# EAGLE design RC_Controller_2 (EAGLE 9.6.2)

## Sheet 1 of 3
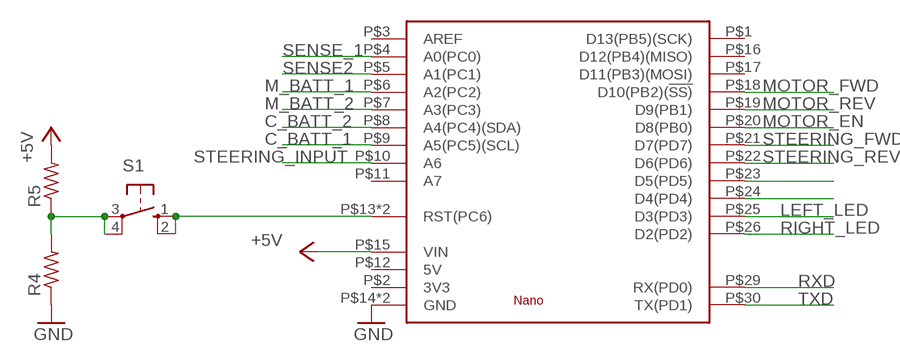
[diagram p0: schematic, sheet 1]

### Parts
R4  R-US_R1206  [R1206]
R5  R-US_R1206  [R1206]
S1  10-XX  [B3F-10XX]
U$1  ARDUINO_NANO  [NANO]

### Nets
+5V: R5.2 U$1.P$15(VIN) ; also sheet 2,3
C_BATT_1: U$1.P$9(A5(PC5)(SCL)) ; also sheet 3
C_BATT_2: U$1.P$8(A4(PC4)(SDA)) ; also sheet 3
GND: R4.1 U$1.P$14(GND) U$1.P$27(GND) ; also sheet 2,3
LEFT_LED: U$1.P$25(D3(PD3)) ; also sheet 3
M_BATT_1: U$1.P$6(A2(PC2)) ; also sheet 3
M_BATT_2: U$1.P$7(A3(PC3)) ; also sheet 3
MOTOR_EN: U$1.P$20(D8(PB0)) ; also sheet 2
MOTOR_FWD: U$1.P$18(D10(PB2)(!SS)) ; also sheet 2
MOTOR_REV: U$1.P$19(D9(PB1)) ; also sheet 2
N$3: U$1.P$24(D4(PD4))
N$4: U$1.P$23(D5(PD5))
N$5: S1.1(S) S1.2(S1) U$1.P$13(RST(PC6)) U$1.P$28(RST(PC6))
N$6: R4.2 R5.1 S1.3(P) S1.4(P1)
RIGHT_LED: U$1.P$26(D2(PD2)) ; also sheet 3
RXD: U$1.P$29(RX(PD0)) ; also sheet 3
SENSE2: U$1.P$5(A1(PC1)) ; also sheet 2
SENSE_1: U$1.P$4(A0(PC0)) ; also sheet 2
STEERING_FWD: U$1.P$21(D7(PD7)) ; also sheet 2
STEERING_INPUT: U$1.P$10(A6) ; also sheet 3
STEERING_REV: U$1.P$22(D6(PD6)) ; also sheet 2
TXD: U$1.P$30(TX(PD1)) ; also sheet 3
Unconnected: U$1.P$1(D13(PB5)(SCK)) U$1.P$2(3V3) U$1.P$3(AREF) U$1.P$11(A7) U$1.P$12(5V) U$1.P$16(D12(PB4)(MISO)) U$1.P$17(D11(PB3)(MOSI))

## Sheet 2 of 3
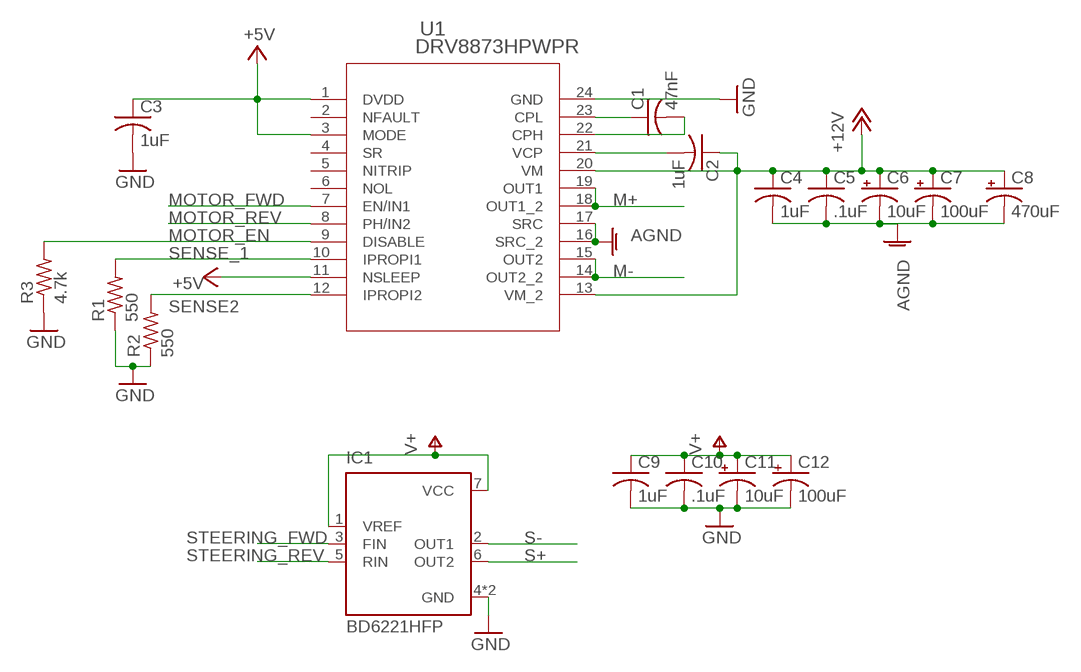
[diagram p1: schematic, sheet 2]

### Parts
C1  47nF  C-USC1206  [C1206]
C2  1uF  C-USC1206  [C1206]
C3  1uF  C-USC1206  [C1206]
C4  1uF  C-USC1206  [C1206]
C5  .1uF  C-USC1206  [C1206]
C6  10uF  CPOL-USE2.5-6  [E2,5-6]
C7  100uF  CPOL-USE2.5-6  [E2,5-6]
C8  470uF  CPOL-USE2.5-6  [E2,5-6]
C9  1uF  C-USC1206  [C1206]
C10  .1uF  C-USC1206  [C1206]
C11  10uF  CPOL-USE2.5-6  [E2,5-6]
C12  100uF  CPOL-USE2.5-6  [E2,5-6]
IC1  BD6221HFP  [HRP7]
R1  550  R-US_R1206  [R1206]
R2  550  R-US_R1206  [R1206]
R3  4.7k  R-US_R1206  [R1206]
U1  DRV8873HPWPR  [PWP24_TEX]

### Nets
+5V: C3.1 U1.1(DVDD) U1.3(MODE) U1.11(NSLEEP) ; also sheet 1,3
+12V: C2.1 C4.1 C5.1 C6.+ C7.+ C8.+ U1.13(VM_2) U1.20(VM) ; also sheet 3
AGND: C4.2 C5.2 C6.- C7.- C8.- U1.16(SRC_2) U1.17(SRC) ; also sheet 3
GND: C3.2 C9.2 C10.2 C11.- C12.- IC1.4(GND) IC1.P(GND) R1.1 R2.1 R3.1 U1.24(GND) ; also sheet 1,3
M+: U1.18(OUT1_2) U1.19(OUT1) ; also sheet 3
M-: U1.14(OUT2_2) U1.15(OUT2) ; also sheet 3
MOTOR_EN: R3.2 U1.9(DISABLE) ; also sheet 1
MOTOR_FWD: U1.7(EN/IN1) ; also sheet 1
MOTOR_REV: U1.8(PH/IN2) ; also sheet 1
N$9: C2.2 U1.21(VCP)
N$10: C1.1 U1.23(CPL)
N$11: C1.2 U1.22(CPH)
S+: IC1.6(OUT2) ; also sheet 3
S-: IC1.2(OUT1) ; also sheet 3
SENSE2: R2.2 U1.12(IPROPI2) ; also sheet 1
SENSE_1: R1.2 U1.10(IPROPI1) ; also sheet 1
STEERING_FWD: IC1.3(FIN) ; also sheet 1
STEERING_REV: IC1.5(RIN) ; also sheet 1
V+: C9.1 C10.1 C11.+ C12.+ IC1.1(VREF) IC1.7(VCC) ; also sheet 3
Unconnected: U1.2(NFAULT) U1.4(SR) U1.5(NITRIP) U1.6(NOL)

## Sheet 3 of 3
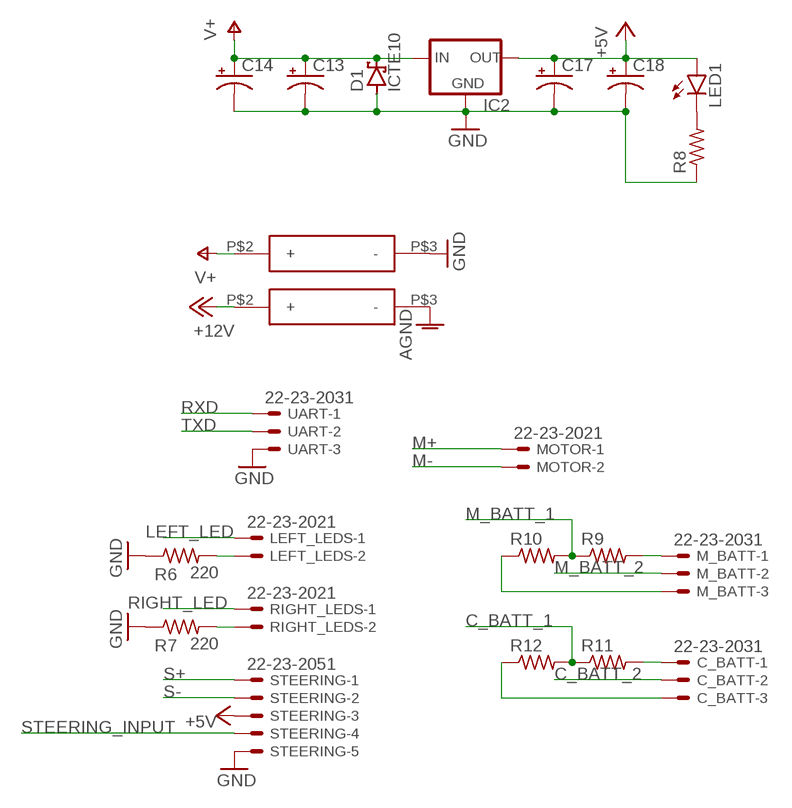
[diagram p2: schematic, sheet 3]

### Parts
C13  CPOL-USE2.5-6  [E2,5-6]
C14  CPOL-USE2.5-6  [E2,5-6]
C17  CPOL-USE2.5-6  [E2,5-6]
C18  CPOL-USE2.5-6  [E2,5-6]
C_BATT  22-23-2031  [22-23-2031]
D1  ICTE10  P6KEXX  [CB417-15]
IC2  78XXL  [78XXL]
LED1  LED3MM  [LED3MM]
LEFT_LEDS  22-23-2021  [22-23-2021]
M_BATT  22-23-2031  [22-23-2031]
MOTOR  22-23-2021  [22-23-2021]
R6  220  R-US_0207/7  [0207/7]
R7  220  R-US_0207/7  [0207/7]
R8  R-US_0207/7  [0207/7]
R9  R-US_0207/7  [0207/7]
R10  R-US_0207/7  [0207/7]
R11  R-US_0207/7  [0207/7]
R12  R-US_0207/7  [0207/7]
RIGHT_LEDS  22-23-2021  [22-23-2021]
STEERING  22-23-2051  [22-23-2051]
U$2  BATT_TERM  [BATT_TERM]
U$3  BATT_TERM  [BATT_TERM]
UART  22-23-2031  [22-23-2031]

### Nets
+5V: C17.+ C18.+ IC2.OUT LED1.A STEERING.3 ; also sheet 1,2
+12V: U$3.P$2(+) ; also sheet 2
AGND: U$3.P$3(-) ; also sheet 2
C_BATT_1: R11.1 R12.2 ; also sheet 1
C_BATT_2: C_BATT.2 ; also sheet 1
GND: C13.- C14.- C17.- C18.- D1.A IC2.GND R6.1 R7.1 R8.1 STEERING.5 U$2.P$3(-) UART.3 ; also sheet 1,2
LEFT_LED: LEFT_LEDS.1 ; also sheet 1
M+: MOTOR.1 ; also sheet 2
M-: MOTOR.2 ; also sheet 2
M_BATT_1: R9.1 R10.2 ; also sheet 1
M_BATT_2: M_BATT.2 ; also sheet 1
N$7: LEFT_LEDS.2 R6.2
N$8: R7.2 RIGHT_LEDS.2
N$12: LED1.K(C) R8.2
N$13: M_BATT.1 R9.2
N$14: C_BATT.1 R11.2
N$15: C_BATT.3 R12.1
N$16: M_BATT.3 R10.1
RIGHT_LED: RIGHT_LEDS.1 ; also sheet 1
RXD: UART.1 ; also sheet 1
S+: STEERING.1 ; also sheet 2
S-: STEERING.2 ; also sheet 2
STEERING_INPUT: STEERING.4 ; also sheet 1
TXD: UART.2 ; also sheet 1
V+: C13.+ C14.+ D1.C IC2.IN U$2.P$2(+) ; also sheet 2

## Library data of the parts
C1-C5 C9 C10 = rcl:C-US: CAPACITOR, American symbol; SPICEPREFIX: C
C6-C8 C11-C14 C17 C18 = rcl:CPOL-US: POLARIZED CAPACITOR, American symbol; SPICEPREFIX: C
C_BATT M_BATT UART = con-molex:22-23-2031: .100" (2.54mm) Center Header - 3 Pin; MF: MOLEX; MPN: 22-23-2031; OC_FARNELL: 1462950; OC_NEWARK: 30C0862
D1 = diode:P6KEXX: DIODE transient-voltage suppressor
IC1 = rohm:BD622*HFP: H-bridge drivers (18V max.) Source: http://www.farnell.com/datasheets/389117.pdf
IC2 = v-reg:78XXL: VOLTAGE REGULATOR
LED1 = led:LED: LED OSRAM: - CHIPLED LG R971, LG N971, LY N971, LG Q971, LY Q971, LO R971, LY R971 LH N974, LH R974 LS Q976, LO Q976, LY Q976 LO Q996 - Hyper CHIPLED LW Q18S LB Q993, LB Q99A, LB R99A - SideLED LS A670, LO A670, LY A670, LG A670, LP A670 LB A673, LV A673, LT A673, LW A673 LH A674 LY A675 LS A676, LA A676, LO A676, LY A676, LW A676 LS A679, LY A679, LG A679 - Hyper Micro SIDELED® LS Y876, LA Y876, LO Y876, LY Y876 LT Y87S - SmartLED LW L88C, LW L88S LB L89C, LB L89S, LG L890 LS L89K, LO L89K, LY L89K LS L896, LA L896, LO L896, LY L896 - TOPLED LS T670, LO T670, LY T670, LG T670, LP T670 LSG T670, LSP T670, LSY T670, LOP T670, LYG T670 LG T671, LOG T671, LSG T671 LB T673, LV T673, LT T673, LW T673 LH T674 LS T676, LA T676, LO T676, LY T676, LB T676, LH T676, LSB T676, LW T676 LB T67C, LV T67C, LT T67C, LS T67K, LO T67K, LY T67K, LW E67C LS E67B, LA E67B, LO E67B, LY E67B, LB E67C, LV E67C, LT E67C LW T67C LS T679, LY T679, LG T679 LS T770, LO T770, LY T770, LG T770, LP T770 LB T773, LV T773, LT T773, LW T773 LH T774 LS E675, LA E675, LY E675, LS T675 LS T776, LA T776, LO T776, LY T776, LB T776 LHGB T686 LT T68C, LB T68C - Hyper Mini TOPLED® LB M676 - Mini TOPLED Santana® LG M470 LS M47K, LO M47K, LY M47K Source: http://www.osram.convergy.de LUXEON: - LUMILED® LXK2-PW12-R00, LXK2-PW12-S00, LXK2-PW14-U00, LXK2-PW14-V00 LXK2-PM12-R00, LXK2-PM12-S00, LXK2-PM14-U00 LXK2-PE12-Q00, LXK2-PE12-R00, LXK2-PE12-S00, LXK2-PE14-T00, LXK2-PE14-U00 LXK2-PB12-K00, LXK2-PB12-L00, LXK2-PB12-M00, LXK2-PB14-N00, LXK2-PB14-P00, LXK2-PB14-Q00 LXK2-PR12-L00, LXK2-PR12-M00, LXK2-PR14-Q00, LXK2-PR14-R00 LXK2-PD12-Q00, LXK2-PD12-R00, LXK2-PD12-S00 LXK2-PH12-R00, LXK2-PH12-S00 LXK2-PL12-P00, LXK2-PL12-Q00, LXK2-PL12-R00 Source: www.luxeon.com KINGBRIGHT: KA-3528ASYC Source: www.kingbright.com
LEFT_LEDS MOTOR RIGHT_LEDS = con-molex:22-23-2021: .100" (2.54mm) Center Header - 2 Pin; MF: MOLEX; MPN: 22-23-2021; OC_FARNELL: 1462926; OC_NEWARK: 25C3832
R1-R12 = rcl:R-US_: RESISTOR, American symbol; SPICEPREFIX: R
S1 = switch-omron:10-XX: OMRON SWITCH; MPN: B3F-1000; OC_FARNELL: 176432; OC_NEWARK: 36M3542
STEERING = con-molex:22-23-2051: .100" (2.54mm) Center Header - 5 Pin; MF: MOLEX; MPN: 22-23-2051; OC_FARNELL: 1462952; OC_NEWARK: 38C9178
U1 = texas:DRV8873HPWPR; BUILT_BY: EMA_Jessica; COPYRIGHT: Copyright (C) 2018 Accelerated Designs. All rights reserved; MANUFACTURER_PART_NUMBER: DRV8873HPWPR; SOURCELIBRARY: TI_2020-05-18; VENDOR: Texas Instruments
U$1 = misc:ARDUINO_NANO
U$2 U$3 = misc:BATT_TERM

## Board
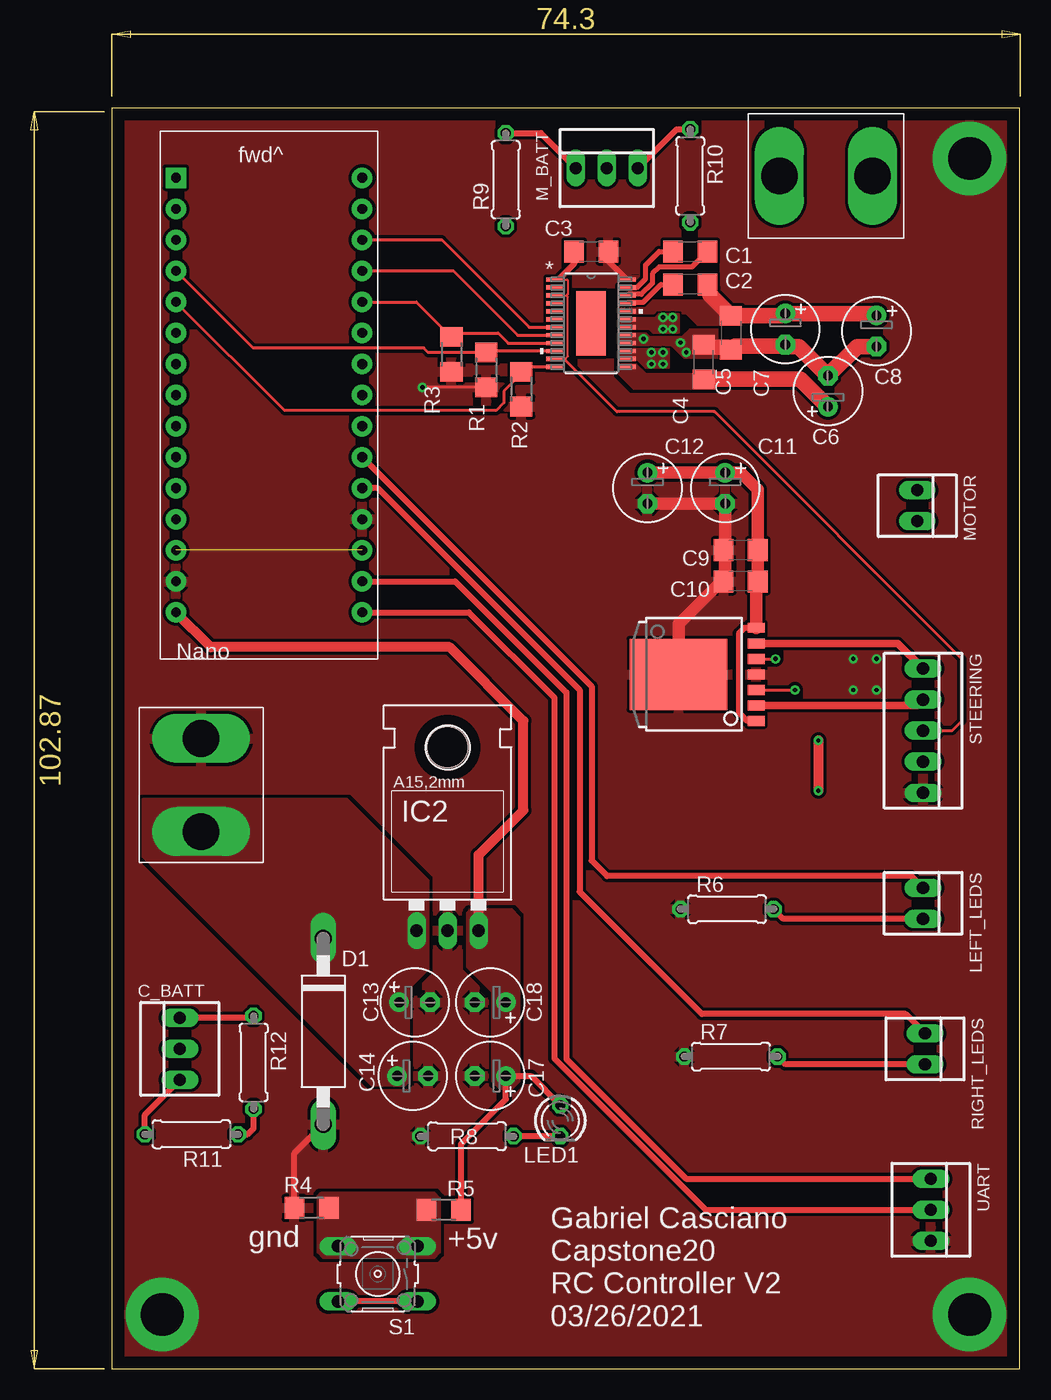
[diagram p3: board, top side]
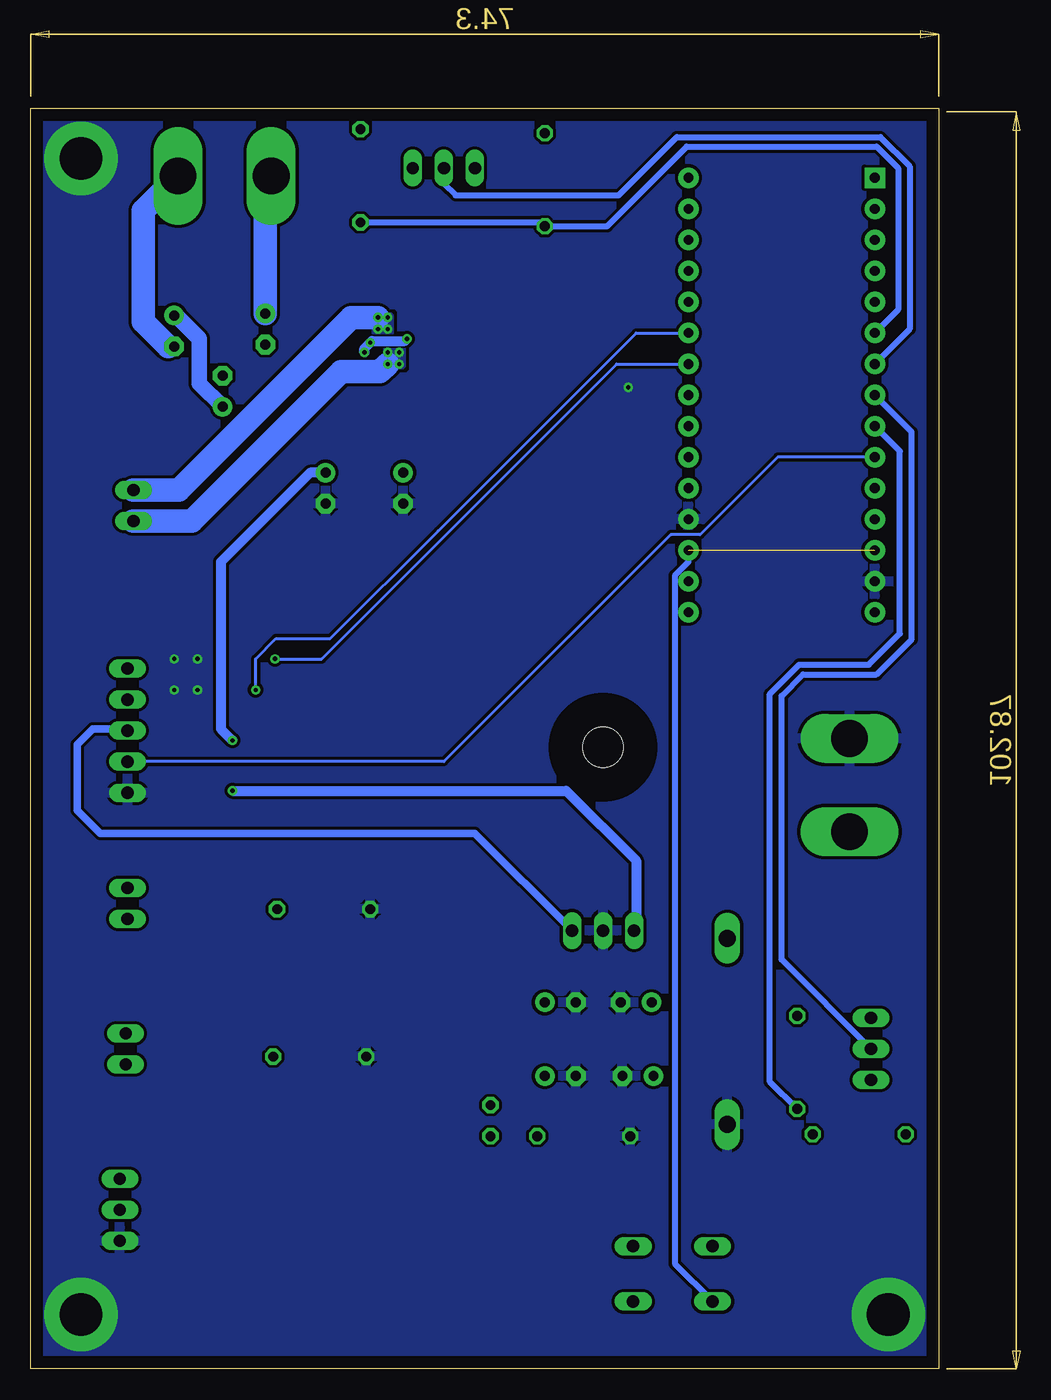
[diagram p4: board, bottom side, seen from below]

Size 74.28 x 103.17 mm. Coordinates in mm from the lower left corner, seen from the top.
Outline: 0,0 74.28,0 74.28,103.17 0,103.17 0,0
Copper layers (1*16): Top 0.035mm / dielectric 1.5mm / Bottom 0.035mm
Design rules "default": minimum track width 6mil, minimum drill 0.35mm, track to track 6mil, track to pad 6mil, pad to pad 6mil, via to via 6mil, smd to smd 6mil, copper to edge 40mil, drill to drill 6mil, minimum pad ring 10mil, minimum via ring 8mil, stop-mask expansion 4mil, vias tented up to drill 0mil, thermal gap 10mil

### Footprints (pad centres in the part's own frame; a part is rotated, then mirrored left to right if it is on the bottom)
C1206 = smd 1.6 x 1.8: 1 -1.4,0; 2 1.4,0
E2,5-6 = drill 0.813 pad 1.6: + -1.27,0 | drill 0.813 pad 1.6 octagon: - 1.27,0
22-23-2031 = drill 1 long: 1 -2.54,0; 2 0,0; 3 2.54,0
CB417-15 = drill 1.397 long: A 7.62,0; C -7.62,0
HRP7 = smd 0.8 x 1.4: 1 -3.81,-5.08; 2 -2.54,-5.08; 3 -1.27,-5.08; 4 0,-5.08; 5 1.27,-5.08; 6 2.54,-5.08; 7 3.81,-5.08 | smd 5.8 x 8: P 0,1.27
78XXL = drill 1.016 long: GND 0,-3.81; IN -2.54,-3.81; OUT 2.54,-3.81 | hole 3.302: 0,11.176
LED3MM = drill 0.813 octagon: A -1.27,0; K 1.27,0
22-23-2021 = drill 1 long: 1 -1.27,0; 2 1.27,0
R1206 = smd 1.6 x 1.803: 1 -1.422,0; 2 1.422,0
0207/7 = drill 0.813 octagon: 1 -3.81,0; 2 3.81,0
B3F-10XX = drill 1.016 long: 1 -3.251,2.261; 2 3.251,2.261; 3 -3.251,-2.261; 4 3.251,-2.261
22-23-2051 = drill 1 long: 1 -5.08,0; 2 -2.54,0; 3 0,0; 4 2.54,0; 5 5.08,0
PWP24_TEX = smd 1.473 x 0.356: 1 -2.921,3.575; 2 -2.921,2.925; 3 -2.921,2.275; 4 -2.921,1.625; 5 -2.921,0.975; 6 -2.921,0.325; 7 -2.921,-0.325; 8 -2.921,-0.975; 9 -2.921,-1.625; 10 -2.921,-2.275; 11 -2.921,-2.925; 12 -2.921,-3.575; 13 2.921,-3.575; 14 2.921,-2.925; 15 2.921,-2.275; 16 2.921,-1.625; 17 2.921,-0.975; 18 2.921,-0.325; 19 2.921,0.325; 20 2.921,0.975; 21 2.921,1.625; 22 2.921,2.275; 23 2.921,2.925; 24 2.921,3.575 | smd 2.413 x 5.283: EPAD 0,0
NANO = drill 0.8 pad 1.676 square: P$1 -7.62,7.62 | drill 0.8 pad 1.676: P$2 -7.62,5.08; P$3 -7.62,2.54; P$4 -7.62,0; P$5 -7.62,-2.54; P$6 -7.62,-5.08; P$7 -7.62,-7.62; P$8 -7.62,-10.16; P$9 -7.62,-12.7; P$10 -7.62,-15.24; P$11 -7.62,-17.78; P$12 -7.62,-20.32; P$13 -7.62,-22.86; P$14 -7.62,-25.4; P$15 -7.62,-27.94; P$16 7.62,7.62; P$17 7.62,5.08; P$18 7.62,2.54; P$19 7.62,0; P$20 7.62,-2.54; P$21 7.62,-5.08; P$22 7.62,-7.62; P$23 7.62,-10.16; P$24 7.62,-12.7; P$25 7.62,-15.24; P$26 7.62,-17.78; P$27 7.62,-20.32; P$28 7.62,-22.86; P$29 7.62,-25.4; P$30 7.62,-27.94
BATT_TERM = drill 3 long: P$2 -10.16,3.81; P$3 -2.54,3.81

### Placement (x,y rotation side)
C1  47.31,91.44 0 top
C2  47.31,88.74 180 top
C3  39.21,91.44 0 top
C4  48.42,82.39 90 top
C5  50.64,84.77 270 top
C6  58.58,80.01 90 top
C7  55.09,85.09 270 top
C8  62.55,84.93 270 top
C9  51.43,66.99 180 top
C10  51.43,64.45 180 top
C11  50.16,72.07 270 top
C12  43.81,72.07 270 top
C13  24.77,30 0 top
C14  24.61,23.97 0 top
C17  30.96,23.97 180 top
C18  30.96,30 180 top
C_BATT  5.56,26.19 90 top
D1  17.3,27.62 270 top
IC1  47.62,56.83 90 top
IC2  27.46,39.69 0 top
LED1  36.67,20.32 270 top
LEFT_LEDS  66.36,38.1 270 top
M_BATT  40.48,98.27 0 top
MOTOR  65.88,70.64 270 top
R1  30.64,81.76 90 top
R2  33.5,80.17 90 top
R3  27.78,83.03 90 top
R4  16.35,13.18 0 top
R5  27.15,13.02 0 top
R6  50.32,37.62 0 top
R7  50.64,25.56 0 top
R8  29.05,19.05 0 top
R9  32.23,97.31 90 top
R10  47.31,97.63 270 top
R11  6.51,19.21 180 top
R12  11.59,25.08 270 top
RIGHT_LEDS  66.52,26.19 270 top
S1  21.75,7.78 180 top
STEERING  66.36,52.23 270 top
U1  39.21,85.57 0 top
U$1  12.86,89.85 0 top
U$2  11.11,54.13 90 top
U$3  64.77,93.82 0 top
UART  66.99,13.02 270 top

### Tracks (layer width: path | path; a pad name or v marks a point on that pad's centre or on a via)
+5V
  Top 0.152: U1.1 36.51,89.14 37.22,89.14 37.31,89.06 37.31,87.95 37.2,87.84 | U1.3 37.2,87.84 | U1.11 36.36,82.71 37.15,82.71 37.31,82.87 37.31,87.73 37.2,87.84
  Top 0.254: STEERING.3 68.74,52.23 69.53,53.02 69.53,58.1 49.31,78.32 41.31,78.32 37,82.64 U1.11
  Top 0.508: C3.1 37.81,90.44 36.51,89.14 | LED1.A 34.29,23.97 C17.+ 32.23,22.07 28.57,18.41 R5.2
  Top 0.813: IC2.OUT 30,42.07 33.66,45.72 33.66,53.02 27.62,59.05 8.1,59.05 U$1.P$15
  Bottom 0.61: IC2.OUT 37.94,43.81 68.58,43.81 70.48,45.72 70.48,51.12 69.22,52.39 66.52,52.39 STEERING.3
  pour Top (no thermals): 29.05,37.31 29.37,37.62 32.7,37.62 33.34,36.99 33.34,23.5 32.7,22.86 31.75,22.86 31.12,23.5 31.12,30.8 29.05,32.86
+12V
  Top 1.27: C8.+ 62.39,86.36 C7.+ 54.9,86.17 C5.1 48.89,87.92 48.89,88.39 48.71,88.58 C2.1 | C6.+ 56.33,80.99 C4.1
  Bottom 1.27: C6.+ 60.48,80.64 60.48,84.32 62.37,86.2 C8.+ | U$3.P$2 55.09,97.16
  Bottom 1.905: 55.09,97.16 C7.+
  pour Top (rank 2, no thermals): 41.43,82.07 41.59,82.23 42.86,82.23 43.66,81.44 49.37,81.44 49.37,80.17 42.7,80.17 41.43,81.44
  pour Top (rank 2, no thermals): 41.43,86.84 43.66,86.84 44.29,87.47 49.69,87.47 50.01,87.15 50.01,85.57 49.85,85.41 47.94,85.41 46.99,86.36 41.43,86.36
AGND  (via drill 0.35)
  Top 1.27: C4.2 48.58,83.63 50.38,83.63 C5.2 50.96,83.69 54.96,83.69 C7.- 55.24,83.66 56.2,83.66 C6.- 60.96,83.66 C8.-
  Bottom 0.813: C7.- 54.93,83.66 | v46.99,83.19 46.99,83.5 v46.51,83.98 46.37,84.12 43.67,84.12 v43.5,84.3
  Bottom 1.27: C8.- 63.05,83.66
  Bottom 1.905: U$3.P$3 65.09,94.77 65.09,85.7 63.05,83.66
  pour Top (rank 2, no thermals): 41.43,84.77 43.66,84.77 43.97,84.45 46.67,84.45 47.31,85.09 49.53,85.09 49.53,82.71 46.83,82.71 45.88,83.66 41.59,83.66 41.43,83.82
C_BATT_1
  Top 0.508: R11.1 11.11,19.21 11.59,19.69 R12.2
  Bottom 0.508: R12.2 13.81,23.5 13.81,55.24 11.43,57.63 5.71,57.63 3.17,60.17 3.17,75.09 U$1.P$9
C_BATT_2
  Bottom 0.508: C_BATT.2 12.86,33.5 12.86,55.09 11.11,56.83 5.08,56.83 2.22,59.69 2.22,76.68 U$1.P$8
GND  (via drill 0.35, 3.5 pad 6)
  Top 0.254: R1.1 v25.4,80.33
  Top 0.508: C3.2 40.61,90.66 U1.24 | R4.1 14.93,17.63 D1.A
  Top 1.016: C12.- C11.- 50.16,64.58 C10.2 49.85,64.45 46.35,60.96 IC1.P
  other vias: 60.64,58.1 62.55,58.1 62.55,55.56 60.64,55.56 70.17,99.06 70.17,4.45 4.13,4.45
  pour Top: 2.54,54.77 24.45,54.77 28.42,50.8 28.42,32.7 30.64,30.48 30.64,22.86 25.08,17.3 16.19,17.3 15.72,17.78 15.72,22.23 16.19,22.7 24.45,22.7 24.92,23.18 24.92,30.48 26.51,32.07 26.51,40.32 19.53,47.31 2.54,47.31
  pour Top (isolate 0.254, rank 3): -1.91,106.05 75.57,106.05 76.84,104.77 76.84,-0.64 74.3,-3.17 0.64,-3.17 -3.17,0.63 -3.17,104.77
  pour Bottom (isolate 0.254, rank 3): -2.86,105.73 74.61,105.73 75.88,104.46 75.88,-0.95 73.34,-3.49 -0.32,-3.49 -5.71,1.9 -5.71,102.87
LEFT_LED
  Top 0.508: U$1.P$25 39.24,55.85 39.24,41.59 40.51,40.32 65.41,40.32 LEFT_LEDS.1
M+  (via drill 0.35)
  Bottom 1.905: MOTOR.1 62.17,71.91 48.04,86.04 v45.88,86.04
  other vias: 45.09,86.04 45.09,85.09 45.88,85.09
  pour Top (no thermals): 41.43,85.88 41.59,86.04 44.45,86.04 44.77,86.36 46.35,86.36 46.35,84.77 44.29,84.77 43.97,85.09 41.59,85.09 41.43,85.25
  pour Bottom (no thermals): 44.61,86.2 44.77,86.36 46.2,86.36 46.35,86.2 46.35,84.77 46.2,84.61 44.77,84.61 44.61,84.77
M-  (via drill 0.35)
  Bottom 1.905: MOTOR.2 61.12,69.37 48.89,81.6 45.72,81.6 v45.09,82.23
  other vias: 44.13,83.19 45.09,83.19 44.13,82.23
  pour Top (no thermals): 41.43,83.34 41.59,83.5 45.56,83.5 45.56,81.91 43.66,81.91 43.02,82.55 41.59,82.55 41.43,82.71
  pour Bottom (no thermals): 43.66,83.5 43.81,83.66 45.24,83.66 45.4,83.5 45.4,82.07 45.24,81.91 43.81,81.91 43.66,82.07
M_BATT_1
  Top 0.508: R10.2 46.99,93.5
  Bottom 0.508: R10.2 32.54,93.82 R9.1 27.14,93.5 20.62,100.02 5.09,100.02 3.33,98.27 3.33,86.68 U$1.P$6
M_BATT_2
  Bottom 0.508: M_BATT.2 40.48,97 39.53,96.04 26.19,96.04 21.42,100.81 4.78,100.81 2.38,98.42 2.38,85.09 U$1.P$7
MOTOR_EN
  Top 0.254: U1.9 32.42,83.94 31.59,84.77 28.11,84.77 R3.2 24.92,87.31 U$1.P$20
MOTOR_FWD
  Top 0.254: U$1.P$18 26.99,92.39 34.14,85.24 U1.7
MOTOR_REV
  Top 0.254: U$1.P$19 27.94,89.85 33.2,84.59 U1.8
N$5  (1 unrouted)
  Top 0.508: S1.1 S1.2
  Bottom 0.508: U$1.P$28 20.48,66.03 21.6,64.92 21.6,8.62 S1.2
N$6
  pour Top (no thermals): 26.35,9.05 17.3,9.05 16.83,9.52 16.83,14.13 17.15,14.45 26.35,14.45 26.83,13.97 26.83,9.52
N$7
  Top 0.508: R6.2 54.93,36.83 LEFT_LEDS.2
N$8
  Top 0.508: R7.2 55.09,24.92 RIGHT_LEDS.2
N$9
  Top 0.406: U1.21 42.22,87.28 43.46,87.28 44.92,88.74 C2.2
N$10
  Top 0.406: U1.23 42.93,88.49 43.66,89.22 43.66,90.33 44.77,91.44 C1.1
N$11
  Top 0.406: C1.2 47.44,90.17 44.77,90.17 44.21,89.62 44.21,88.83 43.32,87.93 42.22,87.93 U1.22
N$12
  Top 0.508: LED1.K R8.2
N$13
  Top 0.508: R9.2 35.08,101.12 M_BATT.1
N$14
  Top 0.508: R11.2 2.7,20.8 C_BATT.1
N$15
  Top 0.508: R12.1 11.43,28.73 C_BATT.3
N$16
  Top 0.508: M_BATT.3 46.2,101.44 R10.1
RIGHT_LED
  Top 0.508: U$1.P$26 21.75,72.07 38.26,55.56 38.26,39.05 48.26,29.05 64.93,29.05 RIGHT_LEDS.1
RXD
  Top 0.508: U$1.P$29 28.08,64.45 37.17,55.36 37.17,25.36 46.97,15.56 UART.1
S+
  Top 0.61: IC1.6 54.93,59.37 55.24,59.37 64.29,59.37 STEERING.1
S-
  Top 0.61: STEERING.2 65.88,54.29 IC1.2
SENSE2
  Top 0.254: U1.12 33.9,81.99 R2.2 33.5,81.44 32.07,80.01 32.07,79.06 31.43,78.42 14.13,78.42 U$1.P$5
SENSE_1
  Top 0.254: U1.10 30.75,83.29 R1.2 25.88,83.18 25.51,83.54 11.55,83.54 U$1.P$4
STEERING_FWD  (via drill 0.35)
  Top 0.254: IC1.3 v55.88,55.56
  Bottom 0.254: v55.88,55.56 55.88,58.1 54.23,59.75 49.79,59.75 40.96,68.58 24.77,84.77 U$1.P$21
STEERING_INPUT
  Bottom 0.254: U$1.P$10 13.18,74.61 19.53,68.26 21.91,68.26 40.48,49.69 STEERING.4
STEERING_REV  (via drill 0.35)
  Top 0.254: IC1.5 v54.29,58.1
  Bottom 0.254: v54.29,58.1 50.48,58.1 26.35,82.23 U$1.P$22
TXD
  Top 0.508: U$1.P$30 29.21,61.91 36.2,54.93 36.2,25.4 48.58,13.02 UART.2
V+  (via drill 0.35)
  Top 0.508: IC1.7 51.74,60.64 51.28,60.18 51.28,53.72 51.98,53.02 IC1.1
  Top 0.813: v57.78,51.43 v57.78,47.31
  Top 1.016: C12.+ C11.+ 51.43,73.34 52.84,71.94 C9.1 C10.1 52.7,64.32 IC1.7
  Bottom 0.813: C11.+ 51.43,73.34 58.74,66.04 58.74,52.39 v57.78,51.43 | v57.78,47.31 30.48,47.31 24.77,41.59 24.77,36.04 IC2.IN
  pour Top (no thermals): 2.54,46.67 19.21,46.67 25.88,40 25.88,32.7 24.29,31.12 24.29,23.5 23.97,23.18 21.27,23.18 2.54,41.91

### Text on the board
tPlace: Gabriel Casciano / Capstone20 / RC Controller V2 / 03/26/2021
tNames: gnd | +5v